# EAGLE schematic home_audio_logic_psu_v0001 (EAGLE 6.4)
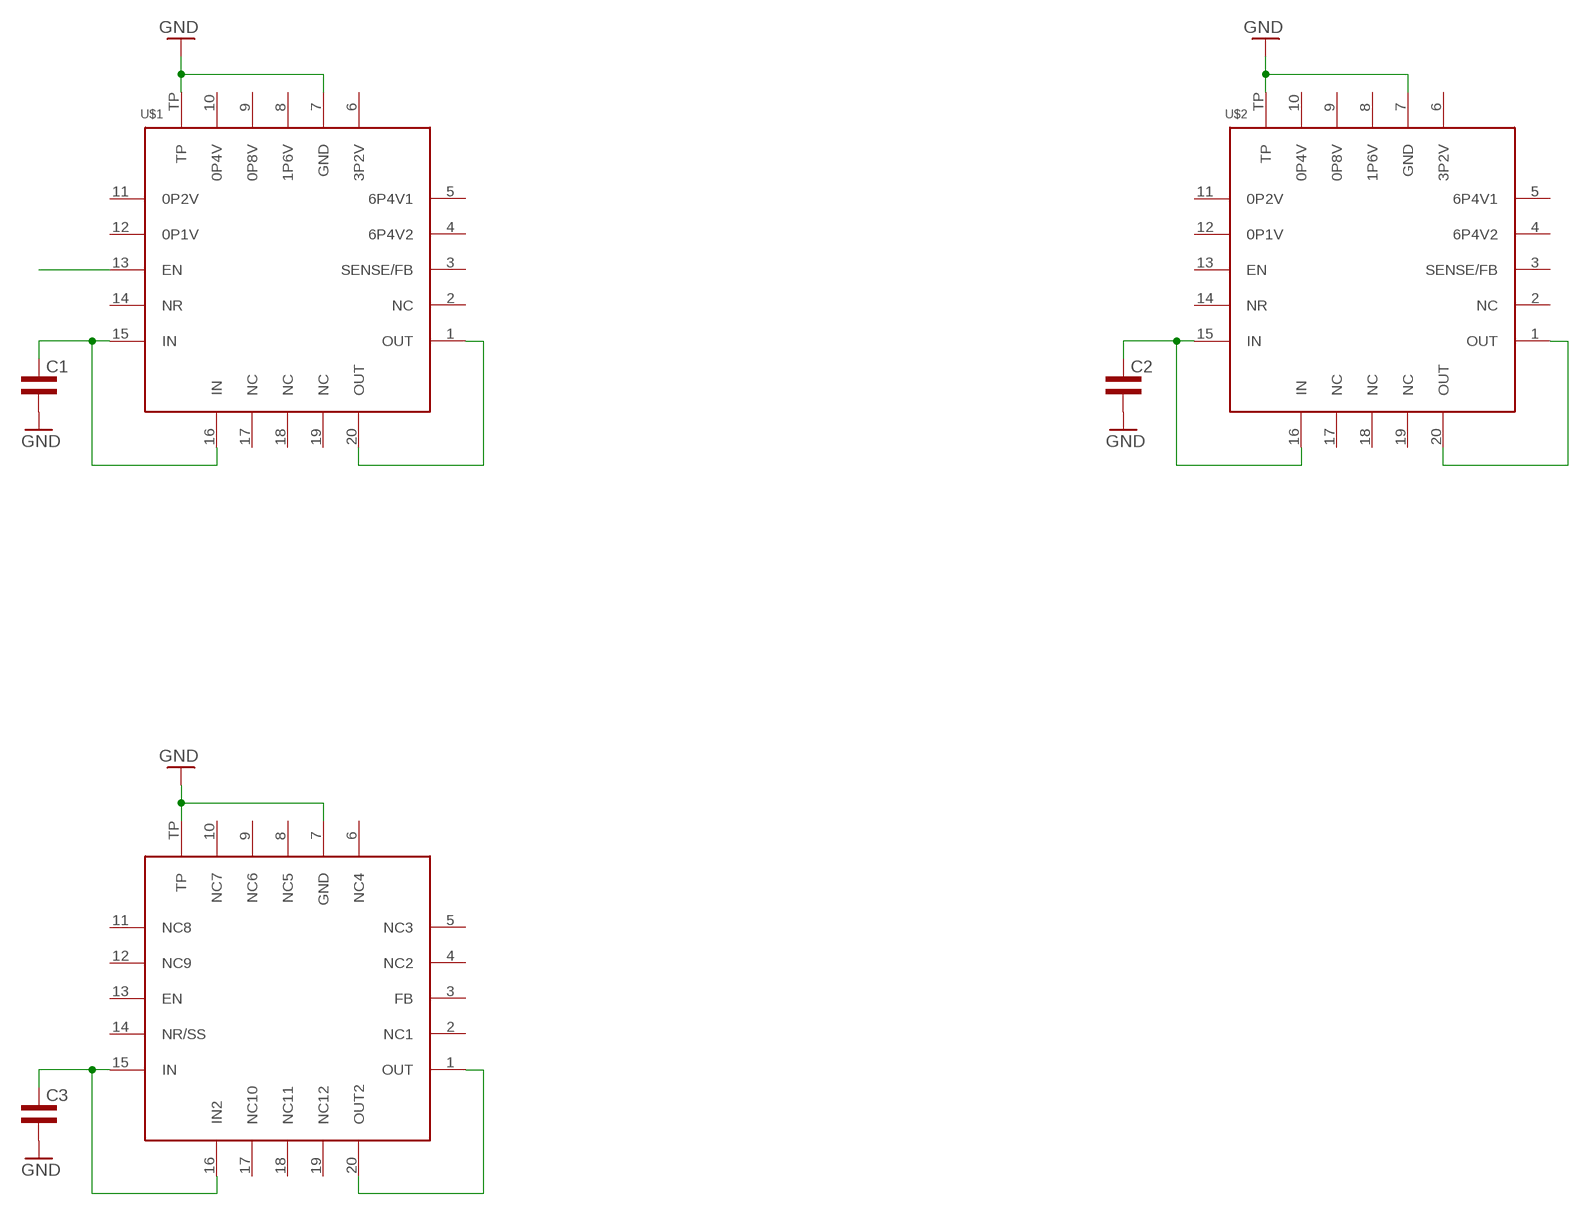
[diagram p0: schematic, sheet 1]

## Parts
C1  CAP1206L3  [1206L3]
C2  CAP1206L3  [1206L3]
C3  CAP1206L3  [1206L3]
U$1  POWER-SUPPLY_POS_V1_TI_LDO_TPS7A4700  [POWER-SUPPLY_POS_V1_TI_LDO_VQFN-20]
U$2  POWER-SUPPLY_POS_V1_TI_LDO_TPS7A4700  [POWER-SUPPLY_POS_V1_TI_LDO_VQFN-20]
U$3  POWER-SUPPLY_POS_V1_TI_LDO_TPS7A3301RGWT  [POWER-SUPPLY_POS_V1_TI_LDO_VQFN-20]

## Nets
GND: C1.2 C2.2 C3.2 U$1.7(GND) U$1.TP U$2.7(GND) U$2.TP U$3.7(GND) U$3.TP
N$1: C1.1 U$1.15(IN) U$1.16(IN)
N$2: C2.1 U$2.15(IN) U$2.16(IN)
N$3: C3.1 U$3.15(IN) U$3.16(IN2)
N$7: U$1.1(OUT) U$1.20(OUT)
N$8: U$2.1(OUT) U$2.20(OUT)
N$9: U$3.1(OUT) U$3.20(OUT2)
N$10: U$1.13(EN)
Unconnected: U$1.2(NC) U$1.3(SENSE/FB) U$1.4(6P4V2) U$1.5(6P4V1) U$1.6(3P2V) U$1.8(1P6V) U$1.9(0P8V) U$1.10(0P4V) U$1.11(0P2V) U$1.12(0P1V) U$1.14(NR) U$1.17(NC) U$1.18(NC) U$1.19(NC) U$2.2(NC) U$2.3(SENSE/FB) U$2.4(6P4V2) U$2.5(6P4V1) U$2.6(3P2V) U$2.8(1P6V) U$2.9(0P8V) U$2.10(0P4V) U$2.11(0P2V) U$2.12(0P1V) U$2.13(EN) U$2.14(NR) U$2.17(NC) U$2.18(NC) U$2.19(NC) U$3.2(NC1) U$3.3(FB) U$3.4(NC2) U$3.5(NC3) U$3.6(NC4) U$3.8(NC5) U$3.9(NC6) U$3.10(NC7) U$3.11(NC8) U$3.12(NC9) U$3.13(EN) U$3.14(NR/SS) U$3.17(NC10) U$3.18(NC11) U$3.19(NC12)

## Library data of the parts
C1-C3 = common:CAP
U$1 U$2 = my_dac_amp:POWER-SUPPLY_POS_V1_TI_LDO_TPS7A4700
U$3 = my_dac_amp:POWER-SUPPLY_POS_V1_TI_LDO_TPS7A3301RGWT: Ultra-Low Noise NEGATIVE Voltage Reglator